# EAGLE design Taster_LED_14 (EAGLE 9.6.1)
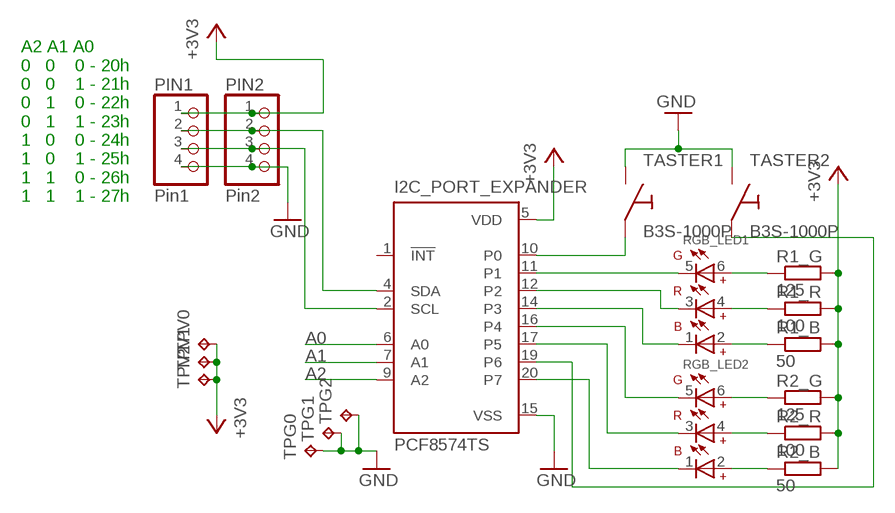
[diagram p0: schematic, sheet 1]

## Parts
I2C_PORT_EXPANDER  PCF8574TS  [SSOP20]
PIN1  Pin1  PINHD-1X4  [1X04]
PIN2  Pin2  PINHD-1X4  [1X04]
R1_B  50  R-EU_R0603  [R0603]
R1_G  125  R-EU_R0603  [R0603]
R1_R  100  R-EU_R0603  [R0603]
R2_B  50  R-EU_R0603  [R0603]
R2_G  125  R-EU_R0603  [R0603]
R2_R  100  R-EU_R0603  [R0603]
RGB_LED1  WL-SFTW_3528_PLCC6_150352M173300  [WL-SFTW_3528_PLCC6]
RGB_LED2  WL-SFTW_3528_PLCC6_150352M173300  [WL-SFTW_3528_PLCC6]
TASTER1  B3S-1000P  [B3S-100P]
TASTER2  B3S-1000P  [B3S-100P]
TPG0  TPTP06SQ  [TP06SQ]
TPG1  TPTP06SQ  [TP06SQ]
TPG2  TPTP06SQ  [TP06SQ]
TPV0  TPTP06SQ  [TP06SQ]
TPV1  TPTP06SQ  [TP06SQ]
TPV2  TPTP06SQ  [TP06SQ]

## Nets
+3V3: I2C_PORT_EXPANDER.5(VDD) PIN1.1 PIN2.1 R1_B.2 R1_G.2 R1_R.2 R2_B.2 R2_G.2 R2_R.2 TPV0.TP TPV1.TP TPV2.TP
A0: I2C_PORT_EXPANDER.6(A0)
A1: I2C_PORT_EXPANDER.7(A1)
A2: I2C_PORT_EXPANDER.9(A2)
CLK: I2C_PORT_EXPANDER.2(SCL) PIN1.3 PIN2.3
DATA: I2C_PORT_EXPANDER.4(SDA) PIN1.2 PIN2.2
GND: I2C_PORT_EXPANDER.15(VSS) PIN1.4 PIN2.4 TASTER1.3 TASTER2.3 TPG0.TP TPG1.TP TPG2.TP
N$1: I2C_PORT_EXPANDER.11(P1) RGB_LED1.5
N$2: R2_B.1 RGB_LED2.2
N$3: R2_R.1 RGB_LED2.4
N$4: R2_G.1 RGB_LED2.6
N$5: R1_G.1 RGB_LED1.6
N$6: R1_R.1 RGB_LED1.4
N$7: R1_B.1 RGB_LED1.2
N$8: I2C_PORT_EXPANDER.19(P6) TASTER2.1
P0: I2C_PORT_EXPANDER.10(P0) TASTER1.1
P3: I2C_PORT_EXPANDER.12(P2) RGB_LED1.3
P4: I2C_PORT_EXPANDER.14(P3) RGB_LED1.1
P5: I2C_PORT_EXPANDER.16(P4) RGB_LED2.5
P6: I2C_PORT_EXPANDER.17(P5) RGB_LED2.3
P7: I2C_PORT_EXPANDER.20(P7) RGB_LED2.1
Unconnected: I2C_PORT_EXPANDER.1(!INT)

## Notes on the sheet
- A2 A1 A0
  0   0    0 - 20h
  0   0    1 - 21h
  0   1    0 - 22h
  0   1    1 - 23h
  1   0    0 - 24h
  1   0    1 - 25h
  1   1    0 - 26h
  1   1    1 - 27h

## Library data of the parts
I2C_PORT_EXPANDER = micro-philips:PCF8574: I2C-Bus Remote 8-bit I/O expander http://www.semiconductors.philips.com/acrobat_download/datasheets/PCF8574_4.pdf; MPN: PCF8574TS/3,118; OC_FARNELL: 1506644; OC_NEWARK: 70R6873
PIN1 PIN2 = pinhead:PINHD-1X4: PIN HEADER
R1_B R1_G R1_R R2_B R2_G R2_R = rcl:R-EU_: RESISTOR, European symbol
RGB_LED1 RGB_LED2 = Eagle_COLOR_LED (rev18b):WL-SFTW_3528_PLCC6: WL-SFTW SMD Full-color TOP LED Waterclear Characteristics PLCC 4, PLCC 6 Low energy consumption High reliability Low current requirement Fast switching No UV/IR radiation High brightness RGB individual control Compact package outline PLCC 4: black surface PLCC 6: white surface Applications PLCC 4: Size 3528 Flash light, switch indicators, equipments indicators, accent and decorative lighting, electronic signage, video displays, backlight for LCDs, PDAs and TVs, vven, microwave, street lighting, ideal for lateral coupling in light guides PLCC 6: Size 3528 TV backlighting, color splashing walls, accent and decorative lighting, optical indicator and RGB LEDs strips PLCC 6: Size 5050 Optical indicator, equipments indicators, electronic signage, interior lighting, wide range of accent and decorative lighting, full color message and displays video boards, consumer appliances: backlight LCDs, PDAs, TVs, industry white goods such as ovens, microwaves, etc. and RGB LEDs strips <http://katalog.we-online.de/media/images/v2/Family_WL-SFTW-neu.jpg> Details see: http://katalog.we-online.de/en/led/WL-SFTW? Created By Yingchun Shan 2018-03-09 2018 (C) Wurth Elektronik
TASTER1 TASTER2 = TASTE_ASIG:B3S-1000P
TPG0 TPG1 TPG2 TPV0 TPV1 TPV2 = testpad:TP: Test pad

## Board
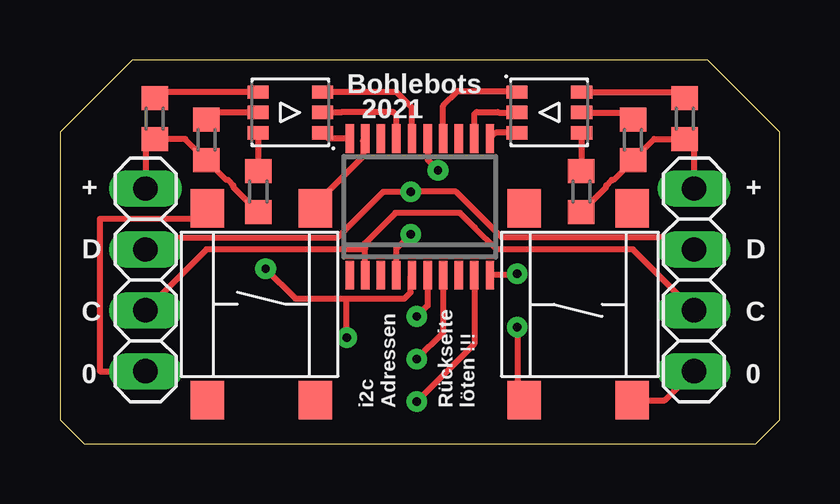
[diagram p1: board, top side]
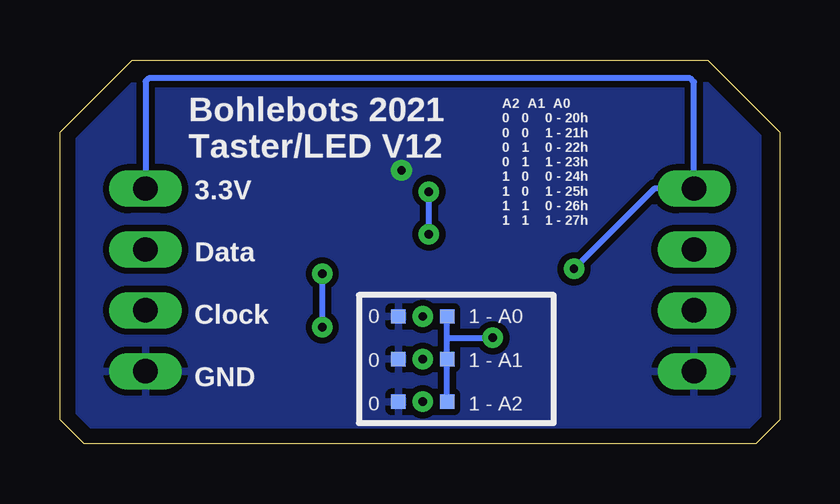
[diagram p2: board, bottom side, seen from below]

Size 30 x 16 mm. Coordinates in mm from the lower left corner, seen from the top.
Outline: 0,13 0,1 1,0 29,0 30,1 30,13 27,16 3,16 0,13
Copper layers (1*16): Top 0.035mm / dielectric 1.5mm / Bottom 0.035mm
Design rules "default": minimum track width 10mil, minimum drill 8mil, track to track 10mil, track to pad 10mil, pad to pad 10mil, via to via 10mil, smd to smd 10mil, copper to edge 25mil, drill to drill 10mil, minimum pad ring 10mil, minimum via ring 10mil, stop-mask expansion 0mil, vias tented up to drill 0mil, thermal gap 10mil

### Footprints (pad centres in the part's own frame; a part is rotated, then mirrored left to right if it is on the bottom)
SSOP20 = smd 0.35 x 1.2: 1 -2.925,-2.85; 2 -2.275,-2.85; 3 -1.625,-2.85; 4 -0.975,-2.85; 5 -0.325,-2.85; 6 0.325,-2.85; 7 0.975,-2.85; 8 1.625,-2.85; 9 2.275,-2.85; 10 2.925,-2.85; 11 2.925,2.85; 12 2.275,2.85; 13 1.625,2.85; 14 0.975,2.85; 15 0.325,2.85; 16 -0.325,2.85; 17 -0.975,2.85; 18 -1.625,2.85; 19 -2.275,2.85; 20 -2.925,2.85
1X04 = drill 1.016 long: 1 -3.81,0; 2 -1.27,0; 3 1.27,0; 4 3.81,0
R0603 = smd 1 x 1.1: 1 -0.85,0; 2 0.85,0
WL-SFTW_3528_PLCC6 = smd 0.89 x 0.55: 1 -1.345,0.85; 2 1.345,0.85; 3 -1.345,0; 4 1.345,0; 5 -1.345,-0.85; 6 1.345,-0.85
B3S-100P = smd 1.6 x 1.4: 1 4,-2.25; 2 -4,-2.25; 3 4,2.25; 4 -4,2.25
TP06SQ = smd 0.6 x 0.6: TP 0,0

### Placement (x,y rotation side)
I2C_PORT_EXPANDER  15,9.87 0 top
PIN1  3.57,6.83 270 top
PIN2  26.43,6.83 270 top
R1_B  26.05,13.56 270 top
R1_G  21.73,10.51 270 top
R1_R  23.89,12.67 270 top
R2_B  8.27,10.51 270 top
R2_G  3.95,13.56 270 top
R2_R  6.11,12.67 270 top
RGB_LED1  20.4,13.81 0 top
RGB_LED2  9.6,13.81 180 top
TASTER1  21.6,5.81 270 top
TASTER2  8.4,5.81 90 top
TPG0  15.89,5.3 0 bottom
TPG1  15.89,3.52 0 bottom
TPG2  15.89,1.74 0 bottom
TPV0  13.86,5.3 0 bottom
TPV1  13.86,3.52 0 bottom
TPV2  13.86,1.74 0 bottom

### Tracks (layer width: path | path; a pad name or v marks a point on that pad's centre or on a via)
+3V3  (via drill 0.35)
  Top 0.254: R1_G.2 22.77,10.7 22.77,10.77 23,10.99 23.06,10.99 R1_R.2 24.78,12.71 R1_B.2 26.43,12.32 PIN2.1 | R2_B.2 7.23,10.7 7.23,10.77 7,10.99 6.94,10.99 R2_R.2 5.22,12.71 R2_G.2 3.57,12.32 PIN1.1 | I2C_PORT_EXPANDER.5 14.62,6.97 14.62,6.3 14.36,6.04 11.95,6.04 | 11.95,6.04 9.81,6.04 v8.57,7.29 | v11.95,4.41 11.95,6.04
  Bottom 0.254: PIN2.1 26.43,15.11 26.3,15.24 3.73,15.24 3.57,15.08 PIN1.1 5.22,10.63 v8.57,7.29 | TPV2.TP TPV1.TP 13.86,4.41 | 13.86,4.41 TPV0.TP | 13.86,4.41 v11.95,4.41
A0  (via drill 0.35)
  Top 0.254: I2C_PORT_EXPANDER.6 15.32,5.75 v14.87,5.3
A1  (via drill 0.35)
  Top 0.254: I2C_PORT_EXPANDER.7 15.97,4.62 v14.87,3.52
A2  (via drill 0.35)
  Top 0.254: I2C_PORT_EXPANDER.9 17.27,4.15 v14.87,1.74
CLK
  Top 0.254: PIN1.3 6.11,8.1 12.71,8.1 | PIN2.3 23.89,8.1 18.21,8.1 17.29,9.02 16.69,9.62 13.98,9.62 12.71,8.35 12.71,8.1 | I2C_PORT_EXPANDER.2 12.71,7.03 12.71,8.1
DATA  (via drill 0.35)
  Top 0.254: PIN1.2 4.08,8.6 11.58,8.6 13.48,10.51 v14.62,10.51 16.52,10.51 18.42,8.6 25.92,8.6 PIN2.2 | I2C_PORT_EXPANDER.4 14.03,8.14 v14.62,8.73
  Bottom 0.254: v14.62,8.73 v14.62,10.51
GND  (via drill 0.35)
  Top 0.254: TASTER1.3 25.22,1.81 PIN2.4 | TASTER2.3 5.7,9.37 1.66,9.37 1.66,3.01 PIN1.4 | I2C_PORT_EXPANDER.15 15.32,11.83 v15.76,11.4
  Bottom 0.254: v15.76,11.4 15.76,11.14
  pour Bottom: 0.9,-0.29 0.9,16.35 29.35,16.35 29.35,-0.29
N$1
  Top 0.254: RGB_LED1.5 18.16,12.96 I2C_PORT_EXPANDER.11
N$2
  Top 0.254: RGB_LED2.2 8.26,11.37 R2_B.1
N$3
  Top 0.254: R2_R.1 6.11,13.81 RGB_LED2.4
N$4
  Top 0.254: RGB_LED2.6 4.21,14.66 R2_G.1
N$5
  Top 0.254: RGB_LED1.6 21.74,11.37 R1_G.1
N$6
  Top 0.254: RGB_LED1.4 23.6,13.81 R1_R.1
N$7
  Top 0.254: RGB_LED1.2 25.8,14.66 R1_B.1
N$8
  Top 0.254: I2C_PORT_EXPANDER.19 12.63,12.63 12.63,11.96 10.65,9.98 TASTER2.1
P0  (via drill 0.35)
  Top 0.254: v19.06,7.08 19.01,7.02 I2C_PORT_EXPANDER.10 | v19.06,4.85 19.06,2.1 TASTER1.1
  Bottom 0.254: v19.06,7.08 v19.06,4.85
P3
  Top 0.254: I2C_PORT_EXPANDER.12 17.27,13.74 17.37,13.83 18.26,13.83 18.28,13.81 RGB_LED1.3
P4
  Top 0.254: I2C_PORT_EXPANDER.14 15.97,14.09 16.59,14.7 19.01,14.7 RGB_LED1.1
P5
  Top 0.254: I2C_PORT_EXPANDER.16 14.68,14.01 14.02,14.66 RGB_LED2.5
P6
  Top 0.254: I2C_PORT_EXPANDER.17 14.03,13.71 13.9,13.83 11.74,13.83 11.72,13.81 RGB_LED2.3
P7
  Top 0.254: I2C_PORT_EXPANDER.20 11.18,12.72 RGB_LED2.1

### Text on the board
tNames: Bohlebots / 2021 | + / / D / / C / / 0 | + / / D / / C / / 0 | i2c / Adressen | Rückseite / löten !!!
bNames: Bohlebots 2021 / Taster/LED V12 | A2 A1 A0 / 0 0 0 - 20h / 0 0 1 - 21h / 0 1 0 - 22h / 0 1 1 - 23h / 1 0 0 - 24h / 1 0 1 - 25h / 1 1 0 - 26h / 1 1 1 - 27h | 3.3V / / Data / / Clock / / GND | 1 - A0 / / 1 - A1 / / 1 - A2 | 0 / / 0 / / 0